# Altium schematic sheet WT2_Screen.SchDoc
size A4
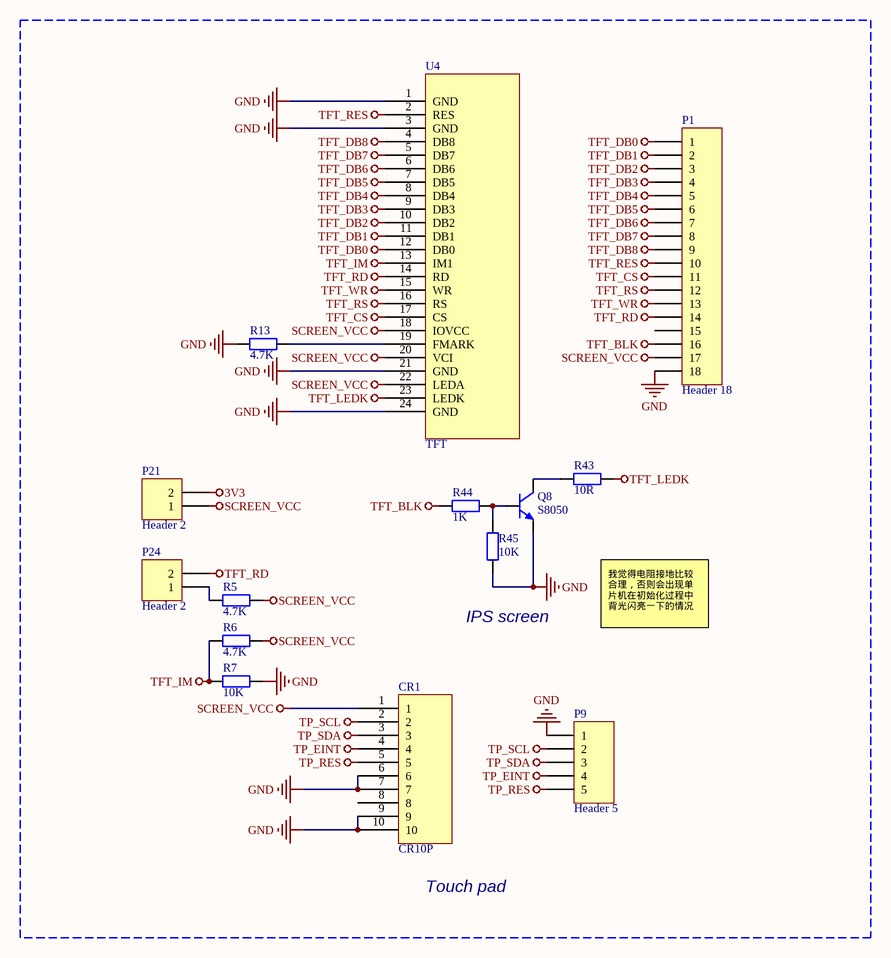
[diagram p0: WT2_Screen.SchDoc]

## Parts
CR1  CR10P  [CONN RCPT 10POS 0.4MM]
P1  Header 18  [HDR1X18]
P9  Header 5  [HDR1X5]
P21  Header 2  [HDR1X2]
P24  Header 2  [HDR1X2]
Q8  S8050  [三极管_SOT-23]
R5  4.7K  [电阻_R0603]
R6  4.7K  [电阻_R0603]
R7  10K  [电阻_R0603]
R13  4.7K  [电阻_R0603]
R43  10R  [电阻_R0603]
R44  1K  [电阻_R0603]
R45  10K  [电阻_R0603]
U4  TFT  [CONN-SMD_DF37NC-24DS-0.4V(51)]

## Nets
3V3: P21.2
GND: CR1.6 CR1.7 CR1.9 CR1.10 P1.18 P9.1 Q8.3(E) R7.1 R13.1 R45.1 U4.1(GND) U4.3(GND) U4.21(GND) U4.24(GND)
SCREEN_VCC: CR1.1 P1.17 P21.1 R5.2 R6.2 U4.18(IOVCC) U4.20(VCI) U4.22(LEDA)
TFT_BLK: P1.16 R44.1
TFT_CS: P1.11 U4.17(CS)
TFT_DB0: P1.1 U4.12(DB0)
TFT_DB1: P1.2 U4.11(DB1)
TFT_DB2: P1.3 U4.10(DB2)
TFT_DB3: P1.4 U4.9(DB3)
TFT_DB4: P1.5 U4.8(DB4)
TFT_DB5: P1.6 U4.7(DB5)
TFT_DB6: P1.7 U4.6(DB6)
TFT_DB7: P1.8 U4.5(DB7)
TFT_DB8: P1.9 U4.4(DB8)
TFT_IM: R6.1 R7.2 U4.13(IM1)
TFT_LEDK: R43.2 U4.23(LEDK)
TFT_RD: P1.14 P24.2 U4.14(RD)
TFT_RES: P1.10 U4.2(RES)
TFT_RS: P1.12 U4.16(RS)
TFT_WR: P1.13 U4.15(WR)
TP_EINT: CR1.4 P9.4
TP_RES: CR1.5 P9.5
TP_SCL: CR1.2 P9.2
TP_SDA: CR1.3 P9.3
NetP24_1: P24.1 R5.1
NetQ8_1: Q8.1(B) R44.2 R45.2
NetQ8_2: Q8.2(C) R43.1
NetR13_2: R13.2 U4.19(FMARK)

Not connected (* = marked no-connect by the designer): CR1 8; P1 15

## Notes on the sheet
- (near R45) IPS screen
- 我觉得电阻接地比较合理，否则会出现单片机在初始化过程中背光闪亮一下的情况
- Touch pad

## Library data of the parts
CR1 = CONN RCPT 10P: 板对板连接器
P1 = Header 18: Header, 18-Pin; LatestRevisionDate: 17-Jul-2002; LatestRevisionNote: Re-released for DXP Platform.; Publisher: Altium Limited
P9 = Header 5: Header, 5-Pin; LatestRevisionDate: 17-Jul-2002; LatestRevisionNote: Re-released for DXP Platform.; Publisher: Altium Limited
P21 P24 = Header 2: Header, 2-Pin; LatestRevisionDate: 17-Jul-2002; LatestRevisionNote: Re-released for DXP Platform.; Publisher: Altium Limited
Q8 = Triode-NPN: _Comma: ,; _Current: 500mA; _Footprint: SOT-23; _Name: Triode; _Specification: Triode,NPN,S8050,SOT-23,500mA,40V; _Voltage: 40V; _Polarity: NPN; _Model: S8050
R5 R6 R13 = Res: _Accuracy: 1%; _Power: 1/8W; _Footprint: 0805; _Drift: 100ppm; _Comma: ,; _Specification: Res,0805,4.7K,1%,1/8W,100ppm; _Name: Res; _Value: 4.7K
R7 R45 = Res: _Accuracy: 1%; _Power: 1/8W; _Footprint: 0805; _Drift: 100ppm; _Comma: ,; _Specification: Res,0805,10K,1%,1/8W,100ppm; _Name: Res; _Value: 10K
R43 = Res: _Accuracy: 1%; _Power: 1/8W; _Footprint: 0805; _Drift: 100ppm; _Comma: ,; _Specification: Res,0805,10R,1%,1/8W,100ppm; _Name: Res; _Value: 10R
R44 = Res: _Accuracy: 1%; _Power: 1/8W; _Footprint: 0805; _Drift: 100ppm; _Comma: ,; _Specification: Res,0805,1K,1%,1/8W,100ppm; _Name: Res; _Value: 1K
U4 = TFT_IPS_8Bit_1.54_240*240